# Altium schematic sheet RAM v3.SchDoc
size A; DocumentNumber: 3; SheetNumber: 3; SheetTotal: 6
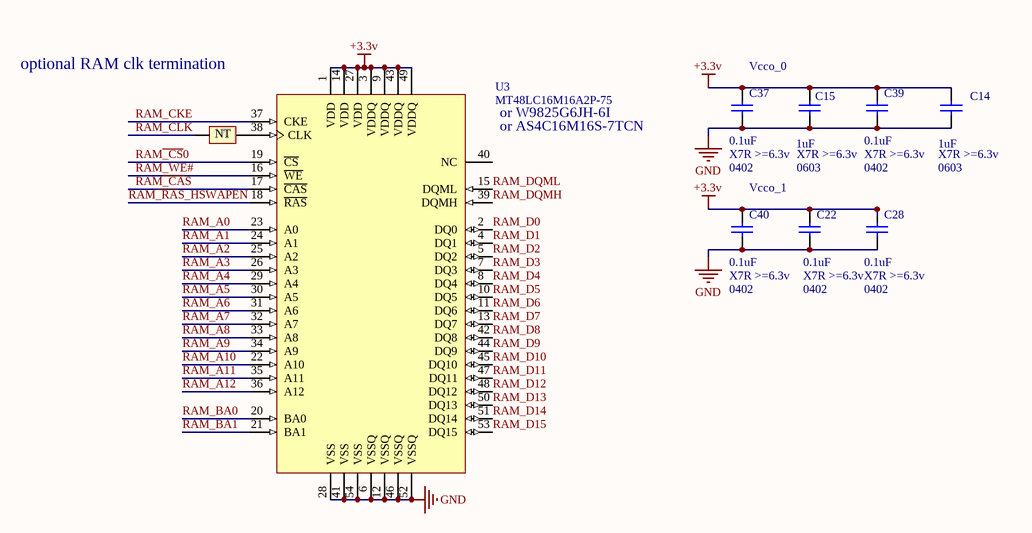
[diagram p0: RAM v3.SchDoc]

## Parts
C14  value 1uF  PackageReference: 0603  Rating: X7R >=6.3v  [CAPC1608N]  (hidden comment: Cap Semi)
C15  value 1uF  PackageReference: 0603  Rating: X7R >=6.3v  [CAPC1608N]  (hidden comment: Cap Semi)
C22  value 0.1uF  PackageReference: 0402  Rating: X7R >=6.3v  [CAPC1005N]  (hidden comment: Cap Semi)
C28  value 0.1uF  PackageReference: 0402  Rating: X7R >=6.3v  [CAPC1005N]  (hidden comment: Cap Semi)
C37  value 0.1uF  PackageReference: 0402  Rating: X7R >=6.3v  [CAPC1005N]  (hidden comment: Cap Semi)
C39  value 0.1uF  PackageReference: 0402  Rating: X7R >=6.3v  [CAPC1005N]  (hidden comment: Cap Semi)
C40  value 0.1uF  PackageReference: 0402  Rating: X7R >=6.3v  [CAPC1005N]  (hidden comment: Cap Semi)
NT1  Net Tie2  [NetTie 0603]  (value not drawn)  (net tie, no BOM)
U3  MT48LC16M16A2P-75  [TSOP2-54_N]

## Nets
+3.3v: C14.2 C15.2 C22.2 C28.2 C37.2 C39.2 C40.2 U3.1(VDD) U3.3(VDDQ) U3.9(VDDQ) U3.14(VDD) U3.27(VDD) U3.43(VDDQ) U3.49(VDDQ)
GND: C14.1 C15.1 C22.1 C28.1 C37.1 C39.1 C40.1 U3.6(VSSQ) U3.12(VSSQ) U3.28(VSS) U3.41(VSS) U3.46(VSSQ) U3.52(VSSQ) U3.54(VSS)
RAM~{_CA}S: U3.17(~{CAS})
RAM~{_CS}0: U3.19(~{CS})
RAM~{_RA}S_HSWAPEN: U3.18(~{RAS})
RAM_A0: U3.23(A0)
RAM_A1: U3.24(A1)
RAM_A2: U3.25(A2)
RAM_A3: U3.26(A3)
RAM_A4: U3.29(A4)
RAM_A5: U3.30(A5)
RAM_A6: U3.31(A6)
RAM_A7: U3.32(A7)
RAM_A8: U3.33(A8)
RAM_A9: U3.34(A9)
RAM_A10: U3.22(A10)
RAM_A11: U3.35(A11)
RAM_A12: U3.36(A12)
RAM_BA0: U3.20(BA0)
RAM_BA1: U3.21(BA1)
RAM_CKE: U3.37(CKE)
RAM_CLK: NT1.1
RAM_D0: U3.2(DQ0)
RAM_D1: U3.4(DQ1)
RAM_D2: U3.5(DQ2)
RAM_D3: U3.7(DQ3)
RAM_D4: U3.8(DQ4)
RAM_D5: U3.10(DQ5)
RAM_D6: U3.11(DQ6)
RAM_D7: U3.13(DQ7)
RAM_D8: U3.42(DQ8)
RAM_D9: U3.44(DQ9)
RAM_D10: U3.45(DQ10)
RAM_D11: U3.47(DQ11)
RAM_D12: U3.48(DQ12)
RAM_D13: U3.50(DQ13)
RAM_D14: U3.51(DQ14)
RAM_D15: U3.53(DQ15)
RAM_DQMH: U3.39(DQMH)
RAM_DQML: U3.15(DQML)
RAM_WE#: U3.16(~{WE})
NetNT1_2: NT1.2 U3.38(CLK)

Not connected (* = marked no-connect by the designer): U3 40(NC)

## Notes on the sheet
- (near U3) optional RAM clk termination
- (near U3) or W9825G6JH-6I
- Vcco_0
- (near U3) or AS4C16M16S-7TCN
- Vcco_1
- (in symbol Net Tie2) NT

## Library data of the parts
C14 C15 = Cap Semi: Capacitor (Semiconductor SIM Model); Substitutable: yes; Supplier 1: Digi-Key; Supplier Part Number 1: 445-4703-1-ND
C22 C28 C40 = Cap Semi: Capacitor (Semiconductor SIM Model); Description: CAP CER 0.1UF 25V 10% X5R 0603; Tolerance: ±10%; Substitutable: yes; Supplier 1: Digi-Key; Supplier Part Number 1: 445-4703-1-ND; Supplier 2: Digi-Key; Supplier Part Number 2: 445-6854-1-ND
C37 C39 = Cap Semi: Capacitor (Semiconductor SIM Model); Substitutable: yes; Tolerance: ±10%; Supplier 1: Digi-Key; Supplier Part Number 1: 445-4703-1-ND; Supplier 2: Digi-Key; Supplier Part Number 2: 445-6854-1-ND
NT1 = Net Tie2: 0603 Net Tie to connect 2 different nets; Substitutable: DNP
U3 = MT48LC16M16A2P-75: 256Mb Synchronous High-Speed CMOS DRAM, 16Mb x 16Bit x 4 Banks, 54-Pin TSOP Pb-free, Commercial; Substitutable: no; PackageReference: TSOP2-54; Value: MT48LC16M16A2P-75; Supplier 1: Digi-Key; Supplier Part Number 1: 557-1059-1-ND; Supplier 2: Arrow; Supplier Part Number 2: 41315055S7057620N2406